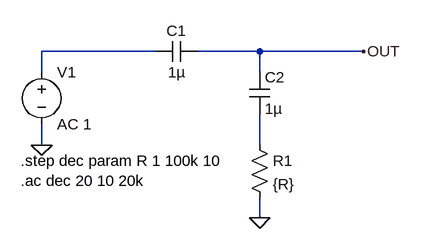
[diagram p0: schematic tone_filter.asc]
tone_filter.asc, the LTspice schematic file:
Version 4
SHEET 1 880 680
WIRE -496 112 -672 112
WIRE -336 112 -432 112
WIRE -176 112 -336 112
WIRE -672 144 -672 112
WIRE -336 144 -336 112
WIRE -672 256 -672 224
WIRE -336 256 -336 208
WIRE -336 368 -336 336
FLAG -672 256 0
FLAG -336 368 0
FLAG -176 112 OUT
SYMBOL voltage -672 128 R0
SYMATTR InstName V1
SYMATTR Value AC 1
SYMBOL cap -432 96 R90
WINDOW 0 0 32 VBottom 2
WINDOW 3 32 32 VTop 2
SYMATTR InstName C1
SYMATTR Value 1µ
SYMBOL cap -352 144 R0
SYMATTR InstName C2
SYMATTR Value 1µ
SYMBOL res -352 240 R0
SYMATTR InstName R1
SYMATTR Value {R}
TEXT -704 280 Left 2 !.step dec param R 1 100k 10\n.ac dec 20 10 20k

The netlist it stands for:
* tone_filter.asc
V1 N001 0 AC 1
C1 OUT N001 1µ
C2 OUT N002 1µ
R1 N002 0 {R}
.step dec param R 1 100k 10
.ac dec 20 10 20k
.backanno
.end